# EAGLE design v8_polygon (EAGLE 5.11)
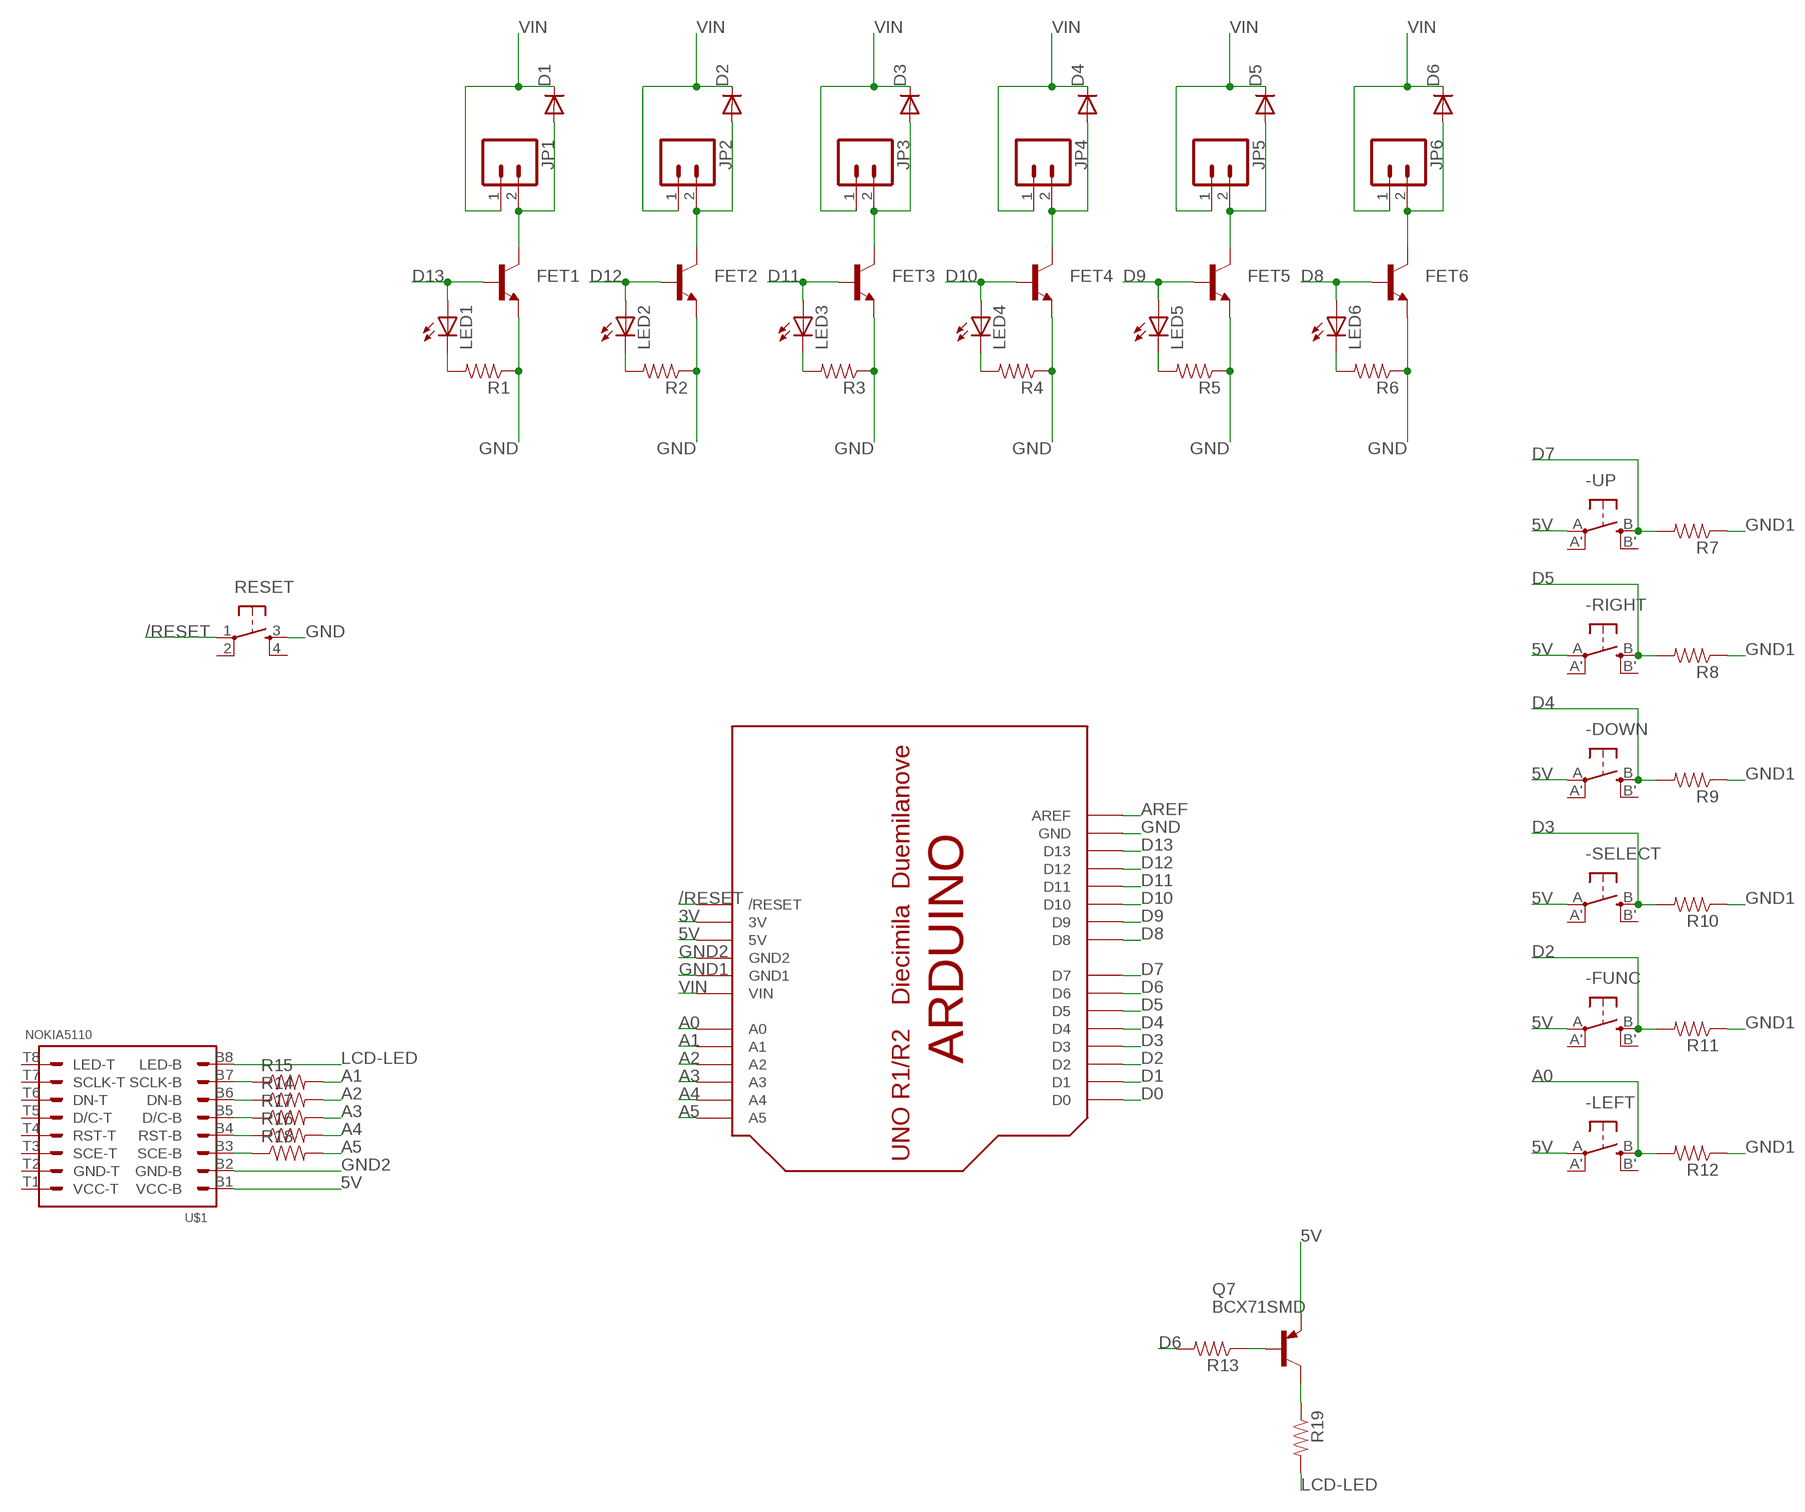
[diagram p0: schematic, sheet 1]

## Parts
-DOWN  SPST_TACT-EVQQ2  [EVQ-Q2]
-FUNC  SPST_TACT-EVQQ2  [EVQ-Q2]
-LEFT  SPST_TACT-EVQQ2  [EVQ-Q2]
-RIGHT  SPST_TACT-EVQQ2  [EVQ-Q2]
-SELECT  SPST_TACT-EVQQ2  [EVQ-Q2]
-UP  SPST_TACT-EVQQ2  [EVQ-Q2]
D1  DIODESOD  [SOD-323]
D2  DIODESOD  [SOD-323]
D3  DIODESOD  [SOD-323]
D4  DIODESOD  [SOD-323]
D5  DIODESOD  [SOD-323]
D6  DIODESOD  [SOD-323]
FET1  TRANSISTOR_NPN  [SOT223]
FET2  TRANSISTOR_NPN  [SOT223]
FET3  TRANSISTOR_NPN  [SOT223]
FET4  TRANSISTOR_NPN  [SOT223]
FET5  TRANSISTOR_NPN  [SOT223]
FET6  TRANSISTOR_NPN  [SOT223]
JP1  M02LOCK_LONGPADS  [1X02_LOCK_LONGPADS]
JP2  M02LOCK_LONGPADS  [1X02_LOCK_LONGPADS]
JP3  M02LOCK_LONGPADS  [1X02_LOCK_LONGPADS]
JP4  M02LOCK_LONGPADS  [1X02_LOCK_LONGPADS]
JP5  M02LOCK_LONGPADS  [1X02_LOCK_LONGPADS]
JP6  M02LOCK_LONGPADS  [1X02_LOCK_LONGPADS]
LED1  LEDCHIPLED_0805  [CHIPLED_0805]
LED2  LEDCHIPLED_0805  [CHIPLED_0805]
LED3  LEDCHIPLED_0805  [CHIPLED_0805]
LED4  LEDCHIPLED_0805  [CHIPLED_0805]
LED5  LEDCHIPLED_0805  [CHIPLED_0805]
LED6  LEDCHIPLED_0805  [CHIPLED_0805]
Q7  BCX71SMD  [SOT23]
R1  RESISTOR  [0805]
R2  RESISTOR  [0805]
R3  RESISTOR  [0805]
R4  RESISTOR  [0805]
R5  RESISTOR  [0805]
R6  RESISTOR  [0805]
R7  RESISTOR  [0805]
R8  RESISTOR  [0805]
R9  RESISTOR  [0805]
R10  RESISTOR  [0805]
R11  RESISTOR  [0805]
R12  RESISTOR  [0805]
R13  RESISTOR  [0805]
R14  RESISTOR  [0805]
R15  RESISTOR  [0805]
R16  RESISTOR  [0805]
R17  RESISTOR  [0805]
R18  RESISTOR  [0805]
R19  RESISTOR  [0805]
RESET  TAC_SWITCHSMD  [TACTILE_SWITCH_SMD]
U$1  NOKIA5110  [NOKIA5110]
U$2  ARDUINOUNO  [ARDUINO]

## Nets
3V: U$2.3V
5V: -DOWN.A(P) -FUNC.A(P) -LEFT.A(P) -RIGHT.A(P) -SELECT.A(P) -UP.A(P) Q7.2(E) U$1.B1(VCC-B) U$2.5V
/RESET: RESET.1 U$2.RESET(/RESET)
A0: -LEFT.B(S) R12.2 U$2.A0
A1: R15.2 U$2.A1
A2: R14.2 U$2.A2
A3: R17.2 U$2.A3
A4: R16.2 U$2.A4
A5: R18.2 U$2.A5
AREF: U$2.AREF
D0: U$2.D0
D1: U$2.D1
D2: -FUNC.B(S) R11.2 U$2.D2
D3: -SELECT.B(S) R10.2 U$2.D3
D4: -DOWN.B(S) R9.2 U$2.D4
D5: -RIGHT.B(S) R8.2 U$2.D5
D6: R13.2 U$2.D6
D7: -UP.B(S) R7.2 U$2.D7
D8: FET6.1(B) LED6.A U$2.D8
D9: FET5.1(B) LED5.A U$2.D9
D10: FET4.1(B) LED4.A U$2.D10
D11: FET3.1(B) LED3.A U$2.D11
D12: FET2.1(B) LED2.A U$2.D12
D13: FET1.1(B) LED1.A U$2.D13
GND: FET1.3(E) FET2.3(E) FET3.3(E) FET4.3(E) FET5.3(E) FET6.3(E) R1.1 R2.1 R3.1 R4.1 R5.1 R6.1 RESET.3 U$2.GND
GND1: R7.1 R8.1 R9.1 R10.1 R11.1 R12.1 U$2.GND1
GND2: U$1.B2(GND-B) U$2.GND2
LCD-LED: R19.2 U$1.B8(LED-B)
N$1: LED2.C R2.2
N$2: LED1.C R1.2
N$3: D2.2(A) FET2.2(C) JP2.2
N$4: Q7.1(B) R13.1
N$5: LED3.C R3.2
N$6: R15.1 U$1.B7(SCLK-B)
N$7: D3.2(A) FET3.2(C) JP3.2
N$8: LED4.C R4.2
N$9: D4.2(A) FET4.2(C) JP4.2
N$10: LED5.C R5.2
N$11: D5.2(A) FET5.2(C) JP5.2
N$12: LED6.C R6.2
N$13: D1.2(A) FET1.2(C) JP1.2
N$14: D6.2(A) FET6.2(C) JP6.2
N$16: Q7.3(C) R19.1
N$32: R14.1 U$1.B6(DN-B)
N$36: R17.1 U$1.B5(D/C-B)
N$38: R16.1 U$1.B4(RST-B)
N$39: R18.1 U$1.B3(SCE-B)
VIN: D1.1(C) D2.1(C) D3.1(C) D4.1(C) D5.1(C) D6.1(C) JP1.1 JP2.1 JP3.1 JP4.1 JP5.1 JP6.1 U$2.VIN
Unconnected: -DOWN.A'(P1) -DOWN.B'(S1) -FUNC.A'(P1) -FUNC.B'(S1) -LEFT.A'(P1) -LEFT.B'(S1) -RIGHT.A'(P1) -RIGHT.B'(S1) -SELECT.A'(P1) -SELECT.B'(S1) -UP.A'(P1) -UP.B'(S1) RESET.2 RESET.4 U$1.T1(VCC-T) U$1.T2(GND-T) U$1.T3(SCE-T) U$1.T4(RST-T) U$1.T5(D/C-T) U$1.T6(DN-T) U$1.T7(SCLK-T) U$1.T8(LED-T)

## Library data of the parts
-DOWN -FUNC -LEFT -RIGHT -SELECT -UP = adafruit:SPST_TACT: SMT 6mm switch, EVQQ2 series http://www.ladyada.net/library/eagle
D1-D6 = SparkFun:DIODE: Diode These are standard reverse protection diodes and small signal diodes. SMA package can handle up to about 1A. SOD-323 can handle about 200mA. What the SOD-323 package when ordering, there are some mfgs out there that are 5-pin packages.
FET1-FET6 = SparkFun:TRANSISTOR_NPN: Transistor NPN BJT configuration in SOT23 package. MMBT2222 is the common NPN we use. Double check BCE configuration again layout.
JP1-JP6 = SparkFun:M02: Header 2 Standard 2-pin 0.1" header. Use with straight break away headers (SKU : PRT-00116), right angle break away headers (PRT-00553), swiss pins (PRT-00743), machine pins (PRT-00117), and female headers (PRT-00115). Molex polarized connector foot print use with SKU : PRT-08233 with associated crimp pins and housings.
LED1-LED6 = led:LED: LED OSRAM: - CHIPLED LG R971, LG N971, LY N971, LG Q971, LY Q971, LO R971, LY R971 LH N974, LH R974 LS Q976, LO Q976, LY Q976 LO Q996 - Hyper CHIPLED LW Q18S LB Q993, LB Q99A, LB R99A - SideLED LS A670, LO A670, LY A670, LG A670, LP A670 LB A673, LV A673, LT A673, LW A673 LH A674 LY A675 LS A676, LA A676, LO A676, LY A676, LW A676 LS A679, LY A679, LG A679 - Hyper Micro SIDELED® LS Y876, LA Y876, LO Y876, LY Y876 LT Y87S - SmartLED LW L88C, LW L88S LB L89C, LB L89S, LG L890 LS L89K, LO L89K, LY L89K LS L896, LA L896, LO L896, LY L896 - TOPLED LS T670, LO T670, LY T670, LG T670, LP T670 LSG T670, LSP T670, LSY T670, LOP T670, LYG T670 LG T671, LOG T671, LSG T671 LB T673, LV T673, LT T673, LW T673 LH T674 LS T676, LA T676, LO T676, LY T676, LB T676, LH T676, LSB T676, LW T676 LB T67C, LV T67C, LT T67C, LS T67K, LO T67K, LY T67K, LW E67C LS E67B, LA E67B, LO E67B, LY E67B, LB E67C, LV E67C, LT E67C LW T67C LS T679, LY T679, LG T679 LS T770, LO T770, LY T770, LG T770, LP T770 LB T773, LV T773, LT T773, LW T773 LH T774 LS E675, LA E675, LY E675, LS T675 LS T776, LA T776, LO T776, LY T776, LB T776 LHGB T686 LT T68C, LB T68C - Hyper Mini TOPLED® LB M676 - Mini TOPLED Santana® LG M470 LS M47K, LO M47K, LY M47K Source: http://www.osram.convergy.de LUXEON: - LUMILED® LXK2-PW12-R00, LXK2-PW12-S00, LXK2-PW14-U00, LXK2-PW14-V00 LXK2-PM12-R00, LXK2-PM12-S00, LXK2-PM14-U00 LXK2-PE12-Q00, LXK2-PE12-R00, LXK2-PE12-S00, LXK2-PE14-T00, LXK2-PE14-U00 LXK2-PB12-K00, LXK2-PB12-L00, LXK2-PB12-M00, LXK2-PB14-N00, LXK2-PB14-P00, LXK2-PB14-Q00 LXK2-PR12-L00, LXK2-PR12-M00, LXK2-PR14-Q00, LXK2-PR14-R00 LXK2-PD12-Q00, LXK2-PD12-R00, LXK2-PD12-S00 LXK2-PH12-R00, LXK2-PH12-S00 LXK2-PL12-P00, LXK2-PL12-Q00, LXK2-PL12-R00 Source: www.luxeon.com KINGBRIGHT: KA-3528ASYC Source: www.kingbright.com
Q7 = transistor-pnp:BCX71SMD: PNP Transistor
R1-R19 = SparkFun:RESISTOR: Resistor Basic schematic elements and footprints for 0603, 1206, and PTH 1/10th watt (small) resistors.
RESET = SparkFun:TAC_SWITCH: Momentary Switch Button commonly used for reset or general input. Spark Fun Electronics SKU : COM-00097
U$1 = CustomLib:NOKIA5110
U$2 = adafruit:ARDUINO: Arduino Diecimila/Duemilanove Make a shield with ease, this package has all the named pins as well as the two mounting drill holes and an outline of the USB and DC power connector. The outline is on the DIMENSION layer, so if your board house uses it they will cut the outline to match. http://www.ladyada.net/library/pcb/eaglelibrary.html

## Board
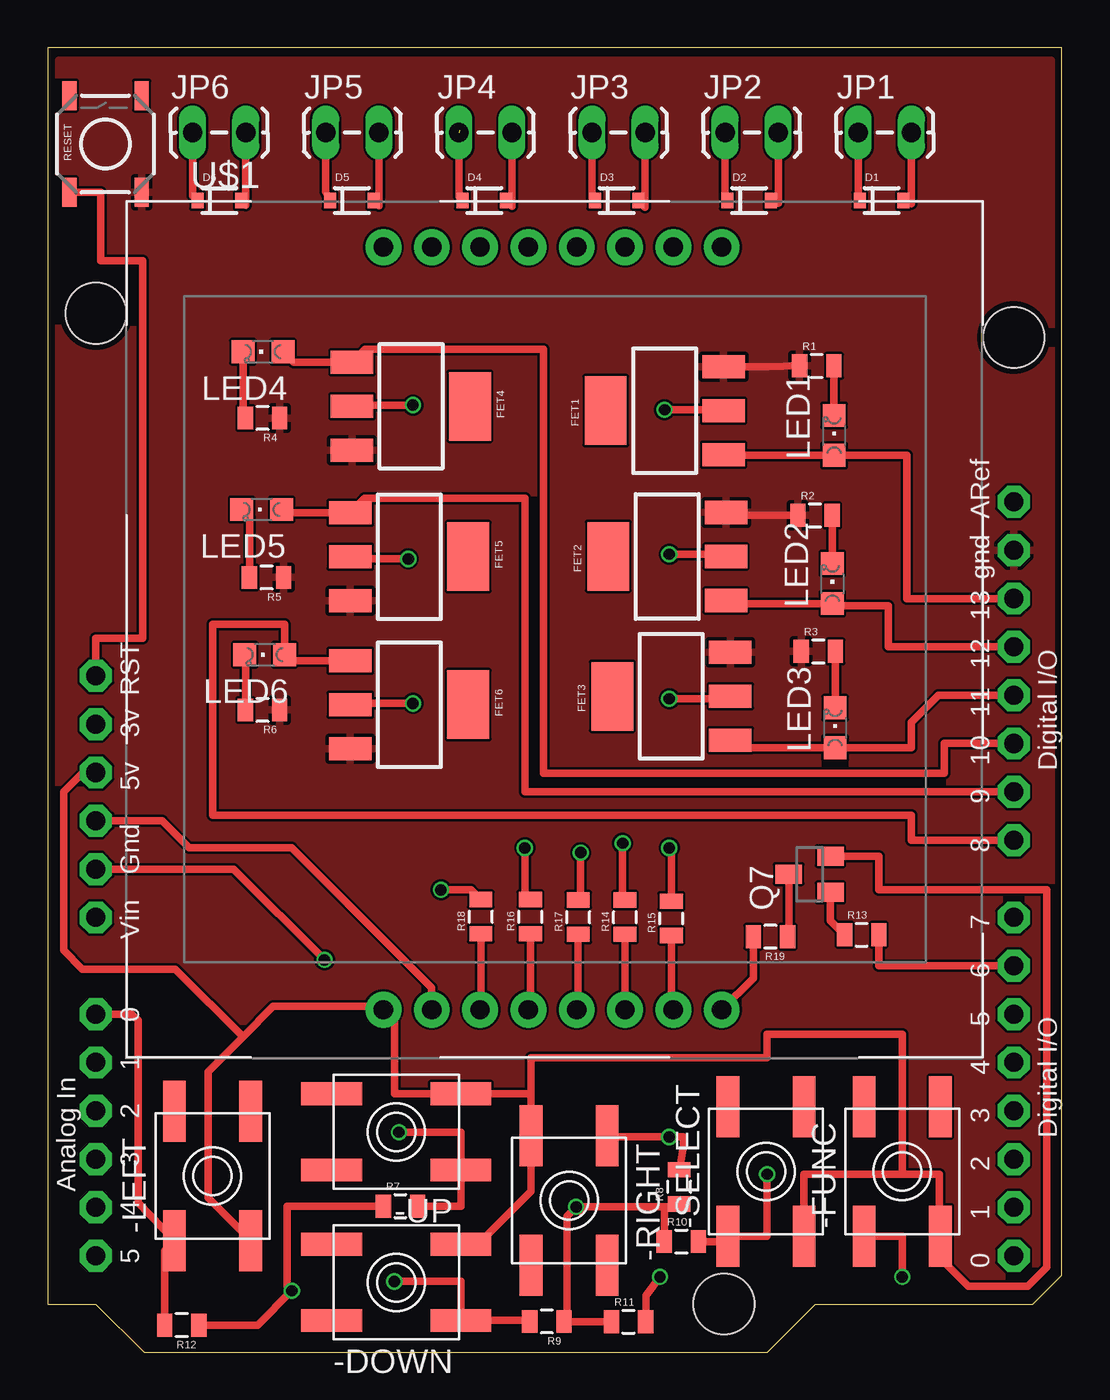
[diagram p1: board, top side]
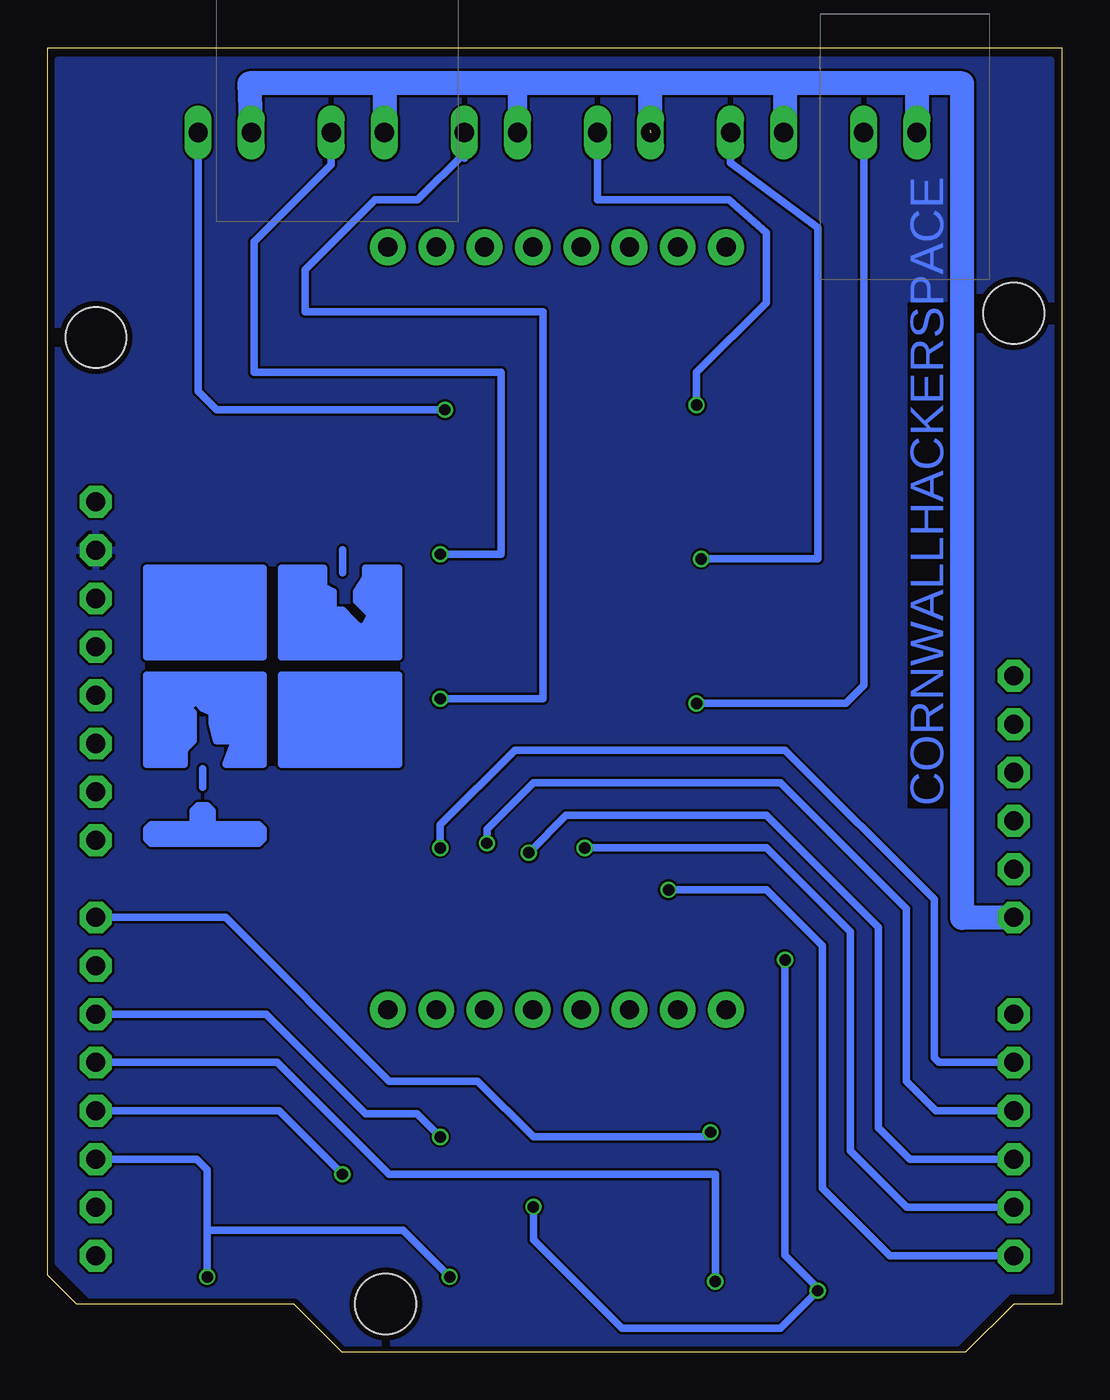
[diagram p2: board, bottom side, seen from below]

Size 53.34 x 68.58 mm. Coordinates in mm from the lower left corner, seen from the top.
Copper layers (1*16): Top 0.035mm / dielectric 1.5mm / Bottom 0.035mm
Design rules "PCB-POOL HighSpec": minimum track width 0.125mm, minimum drill 0.2mm, track to track 0.125mm, track to pad 0.125mm, pad to pad 0.125mm, via to via 0.125mm, smd to smd 0.125mm, copper to edge 0.3mm, drill to drill 0.2mm, minimum pad ring 0.2mm, minimum via ring 0.125mm, stop-mask expansion 0.075mm, vias tented up to drill 0mil, thermal gap 0.2mm

### Footprints (pad centres in the part's own frame; a part is rotated, then mirrored left to right if it is on the bottom)
EVQ-Q2 = smd 3.2 x 1.2: A -3.4,-2; A' 3.4,-2; B -3.4,2; B' 3.4,2
SOD-323 = smd 0.63 x 0.83: 1 -1.15,0; 2 1.15,0
SOT223 = smd 1.219 x 2.235: 1 -2.311,-3.099; 2 0,-3.099; 3 2.311,-3.099 | smd 3.6 x 2.2: 4 0,3.099
1X02_LOCK_LONGPADS = drill 1.016 long: 1 -0.127,0; 2 2.667,0
CHIPLED_0805 = smd 1.2 x 1.2: A 0,-1.05; C 0,1.05
SOT23 = smd 1 x 1.4: 1 -0.95,-1.1; 2 0.95,-1.1; 3 0,1.1
0805 = smd 0.8 x 1.2: 1 -0.9,0; 2 0.9,0
TACTILE_SWITCH_SMD = smd 1.524 x 0.762: 1 -2.54,1.905; 2 2.54,1.905; 3 -2.54,-1.905; 4 2.54,-1.905
NOKIA5110 = drill 1.016 pad 1.88 round: B1 -0.01,0; B2 2.53,0; B3 5.07,0; B4 7.61,0; B5 10.15,0; B6 12.69,0; B7 15.23,0; B8 17.77,0; T1 -0.01,40.08; T2 2.53,40.08; T3 5.07,40.08; T4 7.61,40.08; T5 10.15,40.08; T6 12.69,40.08; T7 15.23,40.08; T8 17.77,40.08
ARDUINO = drill 1 pad 1.676 octagon: 3V 35.56,2.54; 5V 38.1,2.54; A0 50.8,2.54; A1 53.34,2.54; A2 55.88,2.54; A3 58.42,2.54; A4 60.96,2.54; A5 63.5,2.54; AREF 23.876,50.8; D0 63.5,50.8; D1 60.96,50.8; D2 58.42,50.8; D3 55.88,50.8; D4 53.34,50.8; D5 50.8,50.8; D6 48.26,50.8; D7 45.72,50.8; D8 41.656,50.8; D9 39.116,50.8; D10 36.576,50.8; D11 34.036,50.8; D12 31.496,50.8; D13 28.956,50.8; GND 26.416,50.8; GND1 43.18,2.54; GND2 40.64,2.54; RESET 33.02,2.54; VIN 45.72,2.54 | hole 3.2: 15.24,50.8; 66.04,35.56; 13.97,2.54

### Placement (x,y rotation side)
-DOWN  18.33,3.68 180 top
-FUNC  44.94,9.52 90 top
-LEFT  8.67,9.27 90 top
-RIGHT  27.43,7.99 270 top
-SELECT  37.78,9.52 90 top
-UP  18.33,11.59 180 top
D1  43.86,60.54 0 top
D2  36.89,60.54 0 top
D3  29.93,60.54 0 top
D4  22.96,60.54 0 top
D5  16,60.54 0 top
D6  9.04,60.54 0 top
FET1  32.45,49.5 90 top
FET2  32.58,41.84 90 top
FET3  32.8,34.48 90 top
FET4  19.11,49.73 270 top
FET5  19.02,41.82 270 top
FET6  19.02,34.05 270 top
JP1  42.76,64.11 0 top
JP2  35.76,64.11 0 top
JP3  28.75,64.11 0 top
JP4  21.75,64.11 0 top
JP5  14.75,64.11 0 top
JP6  7.75,64.11 0 top
LED1  41.36,48.2 0 top
LED2  41.27,40.41 0 top
LED3  41.41,32.83 0 top
LED4  11.33,52.59 90 top
LED5  11.26,44.3 90 top
LED6  11.42,36.67 90 top
Q7  40.07,25.14 90 top
R1  40.44,51.85 0 top
R2  40.35,44 0 top
R3  40.53,36.84 0 top
R4  11.3,49.11 180 top
R5  11.51,40.73 180 top
R6  11.3,33.77 180 top
R7  18.55,7.69 0 top
R8  33.21,8.7 90 top
R9  26.25,1.63 180 top
R10  33.33,5.83 0 top
R11  30.55,1.62 0 top
R12  7.06,1.44 180 top
R13  42.8,21.96 0 top
R14  30.36,22.87 90 top
R15  32.8,22.81 90 top
R16  25.39,22.9 90 top
R17  27.9,22.87 90 top
R18  22.78,22.9 90 top
R19  38.01,21.85 180 top
RESET  3.04,63.51 90 top
U$1  17.67,18.01 0 top
U$2  0,68.58 270 top

### Tracks (layer width: path | path; a pad name or v marks a point on that pad's centre or on a via)
5V
  Top 0.406: Q7.2 43.71,26.09 43.71,24.31 52.53,24.31 52.53,4.47 51.55,3.49 48.41,3.49 46.94,4.96 -FUNC.A 46.9,6.12 46.9,9.37 44.94,9.37 | -SELECT.A 39.78,9.37 44.94,9.37 | 25.43,13.59 -UP.A 18.23,13.59 18.23,17.44 U$1.B1 17.49,18.19 11.87,18.19 10.27,16.59 | 25.43,13.59 -RIGHT.A 25.43,8.47 22.63,5.68 -DOWN.A | -LEFT.A 10.67,5.9 8.43,8.14 8.43,14.76 10.27,16.59 | U$2.5V 1.86,30.48 0.84,29.46 0.84,21.13 1.82,20.15 6.72,20.15 10.27,16.59 | 44.94,9.37 44.94,16.72 37.84,16.72 37.84,15.49 25.43,15.49 25.43,13.59
/RESET
  Top 0.406: RESET.1 2.8,60.97 2.8,57.39 5,57.39 5,37.54 2.54,37.54 U$2.RESET
A0
  Top 0.406: U$2.A0 4.43,17.78 4.76,17.45 4.76,7.88 -LEFT.B 6.16,5.36 R12.2
A1  (via drill 0.6)
  Top 0.406: R15.2 32.8,26.41 v32.69,26.52
  Bottom 0.406: v32.69,26.52 32.69,27.74 28.77,31.66 14.56,31.66 6.72,23.82 6.72,15.49 6.47,15.24 U$2.A1
A2  (via drill 0.6)
  Top 0.406: R14.2 30.24,23.9 v30.24,26.76
  Bottom 0.406: v30.24,26.76 30.24,27.5 27.79,29.95 14.8,29.95 8.19,23.33 8.19,14.27 6.62,12.7 U$2.A2
A3  (via drill 0.6)
  Top 0.406: R17.2 28.04,23.91 v28.04,26.27
  Bottom 0.406: v28.04,26.27 26.07,28.23 15.54,28.23 9.66,22.35 9.66,11.82 8,10.16 U$2.A3
A4  (via drill 0.6)
  Top 0.406: R16.2 25.09,24.1 v25.09,26.52
  Bottom 0.406: v25.09,26.52 15.54,26.52 11.13,22.11 11.13,10.59 8.16,7.62 U$2.A4
A5  (via drill 0.6)
  Top 0.406: R18.2 22.28,24.31 v20.68,24.31
  Bottom 0.406: v20.68,24.31 15.54,24.31 12.6,21.37 12.6,8.63 9.05,5.08 U$2.A5
D2  (via drill 0.6)
  Top 0.406: -FUNC.B 44.94,6.12 v44.94,3.98 | R11.2 31.45,2.99 v32.2,3.98
  Bottom 0.406: U$2.D2 45.49,10.16 44.94,9.61 44.94,6.43 | 44.94,6.43 v44.94,3.98 | v32.2,3.98 34.65,6.43 44.94,6.43
D3  (via drill 0.6)
  Top 0.406: v37.84,9.37 37.84,6.12 -SELECT.B 35.78,5.83 R10.2
  Bottom 0.406: v37.84,9.37 41.17,12.7 U$2.D3
D4  (via drill 0.6)
  Top 0.406: v18.23,3.73 21.73,3.73 -DOWN.B 24.86,1.68 R9.2
  Bottom 0.406: v18.23,3.73 18.23,9.37 35.38,9.37 41.26,15.24 U$2.D4
D5  (via drill 0.6)
  Top 0.406: -RIGHT.B 29.43,11.33 v32.69,11.33 33.42,11.33 33.42,10.83 R8.2
  Bottom 0.406: v32.69,11.33 33.91,12.55 36.61,12.55 41.84,17.78 U$2.D5
D6
  Top 0.406: U$2.D6 43.7,20.32 R13.2
D7  (via drill 0.6)
  Top 0.406: v18.48,11.57 21.73,11.57 -UP.B 21.73,7.69 R7.2
  Bottom 0.406: v18.48,11.57 18.48,11.33 27.79,11.33 30.73,14.27 35.38,14.27 43.98,22.86 U$2.D7
D8
  Top 0.406: U$2.D8 45.43,26.92 45.43,28.23 8.68,28.23 8.68,38.28 12.47,38.28 LED6.A 12.78,36.36 FET6.1
D9
  Top 0.406: U$2.D9 25.09,29.46 25.09,44.89 16.68,44.89 FET5.1 12.48,44.13 LED5.A
D10
  Top 0.406: U$2.D10 47.14,32 47.14,30.44 26.07,30.44 26.07,52.73 16.7,52.73 FET4.1 12.94,52.04 LED4.A
D11
  Top 0.406: U$2.D11 46.84,34.54 45.43,33.13 45.43,31.78 LED3.A 36.29,31.78 FET3.1
D12
  Top 0.406: U$2.D12 44.2,37.08 44.2,39.26 41.27,39.26 LED2.A 35.84,39.36 FET2.1
D13
  Top 0.406: U$2.D13 45.19,39.62 45.19,47.15 LED1.A 35.59,47.15 FET1.1
GND
  Top 0.406: R1.1 37.87,51.81 FET1.3 | FET2.3 35.83,44 R2.1
  pour Bottom: 52.78,67.92 0.59,67.92 0.59,3.24 2.8,3.24 5.74,0.3 37.59,0.3 40.28,3 51.06,3 52.78,4.71
  pour Top: 0.59,67.92 52.78,67.92 52.78,4.71 51.06,3 40.28,3 37.59,0.3 5.74,0.3 2.8,3.24 0.59,3.24
GND1  (via drill 0.6)
  Top 0.406: R7.1 12.6,7.69 12.6,3.49 v12.84,3.24 11.04,1.44 R12.1 | U$2.GND1 9.79,25.4 v14.56,20.64 | v27.79,7.65 28.04,7.41 | 32.43,5.94 R10.1 32.43,7.64 32.45,7.65 | R8.1 33.21,7.65 32.45,7.65 | v27.79,7.65 27.3,7.16 27.3,1.63 R9.1 27.16,1.62 R11.1 | v27.79,7.65 32.45,7.65
  Bottom 0.406: v14.56,20.64 14.56,5.1 12.84,3.38 v12.84,3.24 14.8,1.28 23.13,1.28 27.79,5.94 v27.79,7.65
GND2
  Top 0.406: U$2.GND2 6.03,27.94 7.46,26.52 12.84,26.52 20.2,19.17 U$1.B2
LCD-LED
  Top 0.406: U$1.B8 37.11,19.68 R19.2
N$1
  Top 0.406: LED2.C 41.26,41.96 R2.2
N$2
  Top 0.406: LED1.C 41.34,49.81 R1.2
N$3  (via drill 0.6)
  Top 0.406: D2.2 38.42,60.41 JP2.2 | FET2.2 35.56,41.95 v32.69,41.95
  Bottom 0.406: JP2.2 38.42,62.43 42.49,58.37 42.49,51.51 29.5,51.51 29.5,41.95 v32.69,41.95
N$4
  Top 0.406: Q7.1 41.17,22.69 R13.1
N$5
  Top 0.406: LED3.C 41.43,34.86 R3.2
N$6
  Top 0.406: U$1.B7 32.8,18.12 R15.1
N$7  (via drill 0.6)
  Top 0.406: D3.2 31.42,60.2 JP3.2 | FET3.2 35.76,34.36 v32.69,34.36
  Bottom 0.406: 32.94,34.36 v32.69,34.36 27.3,34.36 27.3,54.69 39.8,54.69 39.8,56.9 36.12,60.57 33.87,60.57 31.42,63.02 | 31.42,63.02 31.42,62.78 | 31.42,63.02 JP3.2
N$8
  Top 0.406: R4.2 10.28,49.23 LED4.C
N$9  (via drill 0.6)
  Top 0.406: D4.2 24.42,60.23 JP4.2 | FET4.2 16.08,49.79 v19.21,49.79
  Bottom 0.406: JP4.2 24.42,60.57 17.5,60.57 15.54,58.86 15.54,55.18 19.21,51.51 v19.21,49.79
N$10
  Top 0.406: LED5.C 10.62,43.9 R5.2
N$11  (via drill 0.6)
  Top 0.406: D5.2 17.42,60.27 JP5.2 | FET5.2 16.77,41.71 v18.97,41.71
  Bottom 0.406: v18.97,41.71 12.84,41.71 12.84,59.1 17.42,62.53 JP5.2
N$12
  Top 0.406: LED6.C 10.4,36.64 R6.2
N$13  (via drill 0.6)
  Top 0.406: D1.2 45.42,60.37 JP1.2 | FET1.2 35.5,49.55 v32.45,49.55
  Bottom 0.406: v32.45,49.55 44.45,49.55 45.42,50.52 JP1.2
N$14  (via drill 0.6)
  Top 0.406: JP6.2 10.42,60.3 D6.2 | FET6.2 16.66,34.11 v19.21,34.11
  Bottom 0.406: v19.21,34.11 11.38,34.11 10.42,35.06 JP6.2
N$15
  Bottom 0.406: 42,36.8 42,36.56 48.12,36.56 48.12,36.8 | 42,37.3 42,37.05 | 42,37.79 42,37.54 | 42,38.03 42,38.28 | 42,38.52 42,38.77 | 42,39.01 42,39.26 | 42,39.5 42,39.75 | 42,40.23 42,39.99 | 42,40.48 42,41.22 48.12,41.22 48.12,38.77 | 48.12,38.28 48.12,38.52 | 48.12,37.79 48.12,38.03 | 48.12,37.54 48.12,37.3 | 48.12,37.05 48.12,36.8 | 42,36.8 48.12,36.8 | 42,37.05 42,36.8 | 42,37.05 48.12,37.05 | 48.12,37.3 48.12,37.05 | 42,37.3 48.12,37.3 | 42,37.54 42,37.3 | 42,37.54 48.12,37.54 | 48.12,37.79 48.12,37.54 | 42,37.79 48.12,37.79 | 42,37.79 42,38.03 | 42,38.03 48.12,38.03 | 48.12,38.03 48.12,38.28 | 42,38.28 48.12,38.28 | 42,38.28 42,38.52 | 42,38.52 48.12,38.52 | 48.12,38.52 48.12,38.77 | 42,38.77 48.12,38.77 | 42,38.77 42,39.01 | 42,39.01 47.88,39.01 47.88,39.26 42,39.26 | 42,39.26 42,39.5 | 42,39.5 47.88,39.5 47.88,39.75 42,39.75 | 42,39.75 42,39.99 | 42,39.99 47.88,39.99 47.88,40.23 42,40.23 | 42,40.48 42,40.23 | 42,40.48 47.88,40.48 47.88,40.73 42.24,40.73 42.24,40.97 47.88,40.97
N$16
  Top 0.406: R19.1 38.97,21.91 Q7.3
N$32
  Top 0.406: U$1.B6 R14.1
N$36
  Top 0.406: U$1.B5 27.9,18.09 R17.1
N$38
  Top 0.406: U$1.B4 25.39,18.12 R16.1
N$39
  Top 0.406: U$1.B3 22.78,18.05 R18.1
N$96
  Bottom 0.406: 48.12,27.01 47.88,26.76 42.24,26.76 42,27.01 42,27.5 42.24,27.74 42.98,27.74 | 44.7,27.74 45.67,27.74 | 45.67,27.74 47.88,27.74 48.12,27.5 48.12,27.01 | 48.12,27.01 42.24,27.01 42.24,27.5 47.88,27.5 47.88,27.25 42.49,27.25 42.98,27.74 | 42.98,27.74 44.7,27.74 | 44.7,27.74 44.7,28.48 44.94,28.72 45.43,28.72 45.67,28.48 45.67,27.74 | 45.67,27.74 45.43,27.99 44.94,27.99 44.94,28.48 45.43,28.48 45.43,28.23 45.19,28.23
N$97
  Bottom 0.406: 45.19,29.7 45.19,30.68
N$98
  Bottom 0.406: 46.16,30.93 48.12,30.93 48.12,32.15 | 48.12,32.64 48.12,32.4 | 48.12,33.13 48.12,32.89 | 48.12,33.62 48.12,33.38 | 48.12,33.87 48.12,35.58 42,35.58 42,30.93 43.96,30.93 43.47,32.15 44.45,32.15 44.7,33.13 44.7,33.38 | 44.7,33.62 45.19,33.87 | 45.19,33.87 45.43,34.11 45.43,34.6 45.67,34.11 45.92,33.87 | 45.92,33.87 45.67,33.62 | 45.67,33.38 45.67,33.13 | 45.67,32.89 45.67,32.64 | 45.67,32.4 45.67,32.15 45.92,31.91 | 45.92,31.91 46.16,31.66 | 46.16,30.93 46.16,31.42 | 46.16,30.93 46.41,31.17 47.88,31.17 47.88,31.42 | 47.88,31.66 47.88,31.42 | 46.16,31.42 47.88,31.42 | 46.16,31.66 46.16,31.42 | 46.16,31.66 47.88,31.66 | 47.88,31.66 47.88,31.91 45.92,31.91 | 45.92,31.91 45.92,32.15 48.12,32.15 | 48.12,32.4 48.12,32.15 | 45.67,32.4 48.12,32.4 | 45.67,32.64 45.67,32.4 | 45.67,32.64 48.12,32.64 | 48.12,32.89 48.12,32.64 | 45.67,32.89 48.12,32.89 | 45.67,33.13 45.67,32.89 | 45.67,33.13 48.12,33.13 | 48.12,33.38 48.12,33.13 | 45.67,33.38 48.12,33.38 | 45.67,33.62 45.67,33.38 | 45.67,33.62 48.12,33.62 | 48.12,33.87 48.12,33.62 | 45.92,33.87 48.12,33.87 | 45.92,33.87 45.92,34.11 47.88,34.11 47.88,34.36 45.67,34.36 45.67,34.6 47.88,34.6 47.88,34.84 45.43,34.84 45.43,35.09 47.88,35.09 47.88,35.34 42.24,35.34 42.24,35.09 45.19,35.09 45.19,34.84 42.24,34.84 42.24,34.6 45.19,34.6 45.19,34.36 42.24,34.36 42.24,34.11 45.19,34.11 45.19,33.87 | 45.19,33.87 42.24,33.87 42.24,33.62 44.7,33.62 | 44.7,33.38 44.7,33.62 | 44.7,33.38 42.24,33.38 42.24,33.13 44.45,33.13 44.45,32.89 42.24,32.89 42.24,32.64 44.45,32.64 44.45,32.4 42.24,32.4 42.24,32.15 43.23,32.15 43.23,31.91 42.24,31.91 42.24,31.66 43.47,31.66 43.47,31.42 42.24,31.42 42.24,31.17 43.47,31.17
N$99
  Bottom 0.406: 34.89,31.17 34.89,30.93 41.02,30.93 41.02,31.17 | 34.89,31.66 34.89,31.42 | 34.89,32.15 34.89,31.91 | 34.89,32.64 34.89,32.4 | 34.89,32.89 34.89,33.13 | 34.89,33.38 34.89,33.62 | 34.89,33.87 34.89,34.11 | 34.89,34.6 34.89,34.36 | 34.89,34.84 34.89,35.58 41.02,35.58 41.02,33.13 | 41.02,32.64 41.02,32.89 | 41.02,32.4 41.02,32.15 | 41.02,31.91 41.02,31.66 | 41.02,31.42 41.02,31.17 | 34.89,31.17 41.02,31.17 | 34.89,31.42 34.89,31.17 | 34.89,31.42 41.02,31.42 | 41.02,31.66 41.02,31.42 | 34.89,31.66 41.02,31.66 | 34.89,31.91 34.89,31.66 | 34.89,31.91 41.02,31.91 | 41.02,32.15 41.02,31.91 | 34.89,32.15 41.02,32.15 | 34.89,32.4 34.89,32.15 | 34.89,32.4 41.02,32.4 | 41.02,32.64 41.02,32.4 | 34.89,32.64 41.02,32.64 | 34.89,32.64 34.89,32.89 | 34.89,32.89 41.02,32.89 | 41.02,32.89 41.02,33.13 | 34.89,33.13 41.02,33.13 | 34.89,33.13 34.89,33.38 | 34.89,33.38 40.77,33.38 40.77,33.62 34.89,33.62 | 34.89,33.62 34.89,33.87 | 34.89,33.87 40.77,33.87 40.77,34.11 34.89,34.11 | 34.89,34.11 34.89,34.36 | 34.89,34.36 40.77,34.36 40.77,34.6 34.89,34.6 | 34.89,34.84 34.89,34.6 | 34.89,34.84 40.77,34.84 40.77,35.09 35.14,35.09 35.14,35.34 40.77,35.34
N$100
  Bottom 0.406: 41.02,39.26 41.02,40.97 | 41.02,37.79 41.02,39.01 | 41.02,37.54 41.02,36.56 34.89,36.56 34.89,39.5 | 34.89,39.75 34.89,39.5 | 34.89,39.99 34.89,41.22 36.61,41.22 36.61,40.73 | 36.61,40.73 37.1,39.99 37.1,39.75 | 36.37,38.77 37.1,39.5 | 36.61,38.28 36.37,38.77 | 36.61,38.28 36.85,38.03 | 36.85,38.03 37.34,38.52 | 37.34,38.52 37.84,39.01 38.33,39.01 38.33,39.99 38.81,40.23 38.81,41.22 41.02,41.22 41.02,40.97 | 41.02,40.97 39.06,40.97 39.06,40.73 40.77,40.73 40.77,40.48 39.06,40.48 39.06,40.23 40.77,40.23 40.77,39.99 38.57,39.99 38.57,39.75 40.77,39.75 40.77,39.5 38.57,39.5 38.57,39.26 41.02,39.26 | 41.02,39.01 41.02,39.26 | 41.02,39.01 38.57,39.01 38.57,38.77 | 38.57,38.77 40.77,38.77 | 38.57,38.77 37.84,38.77 37.84,38.52 | 37.84,38.52 40.77,38.52 | 37.34,38.52 37.84,38.52 | 37.34,38.52 37.34,38.28 40.77,38.28 40.77,38.03 36.85,38.03 | 36.85,38.03 36.85,37.79 41.02,37.79 | 41.02,37.79 41.02,37.54 | 41.02,37.54 35.14,37.54 35.14,37.3 40.77,37.3 40.77,37.05 35.14,37.05 35.14,36.8 40.77,36.8 40.77,37.79 35.14,37.79 35.14,38.03 36.61,38.03 36.61,38.28 | 36.61,38.28 35.14,38.28 35.14,38.52 36.37,38.52 36.37,38.77 | 36.37,38.77 35.14,38.77 35.14,39.01 36.37,39.01 36.37,39.26 | 36.37,39.26 35.14,39.26 | 36.37,39.26 36.61,39.26 36.61,39.5 | 36.61,39.5 34.89,39.5 | 37.1,39.5 36.61,39.5 | 37.1,39.5 37.1,39.75 | 37.1,39.75 34.89,39.75 | 34.89,39.75 34.89,39.99 | 34.89,39.99 36.85,39.99 36.85,40.23 35.14,40.23 35.14,40.48 36.61,40.48 36.61,40.73 | 36.61,40.73 35.14,40.73 35.14,40.97 36.37,40.97
N$101
  Bottom 0.406: 37.84,42.2 37.84,40.97
VIN  (1 unrouted)
  Top 0.406: D6.1 7.63,60.8 JP6.1 | D5.1 14.63,61.01 JP5.1 | D4.1 21.63,60.73 JP4.1 | D3.1 28.63,60.69 JP3.1 | D2.1 35.63,60.66 JP2.1 | D1.1 42.63,60.62 JP1.1
  Bottom 0.813: JP2.1 | 14.56,64.11 JP5.1
  Bottom 1.016: 28.63,66.7 JP3.1
  Bottom 1.27: JP1.1 42.73,66.7 35.63,66.7 | 35.63,66.7 28.63,66.7 21.66,66.7 | 7.63,66.7 JP6.1 | 7.63,66.7 14.56,66.7 | 14.56,66.7 21.66,66.7 | 21.66,66.7 21.66,64.25 | 35.63,66.7 JP2.1 | 14.56,66.7 14.56,64.11 | 7.63,66.7 5.25,66.7 5.25,22.84 2.54,22.84 U$2.VIN

### Text on the board
Bottom: CORNWALLHACKERSPACE